# EAGLE design lcd_backpack (EAGLE 6.5.0)
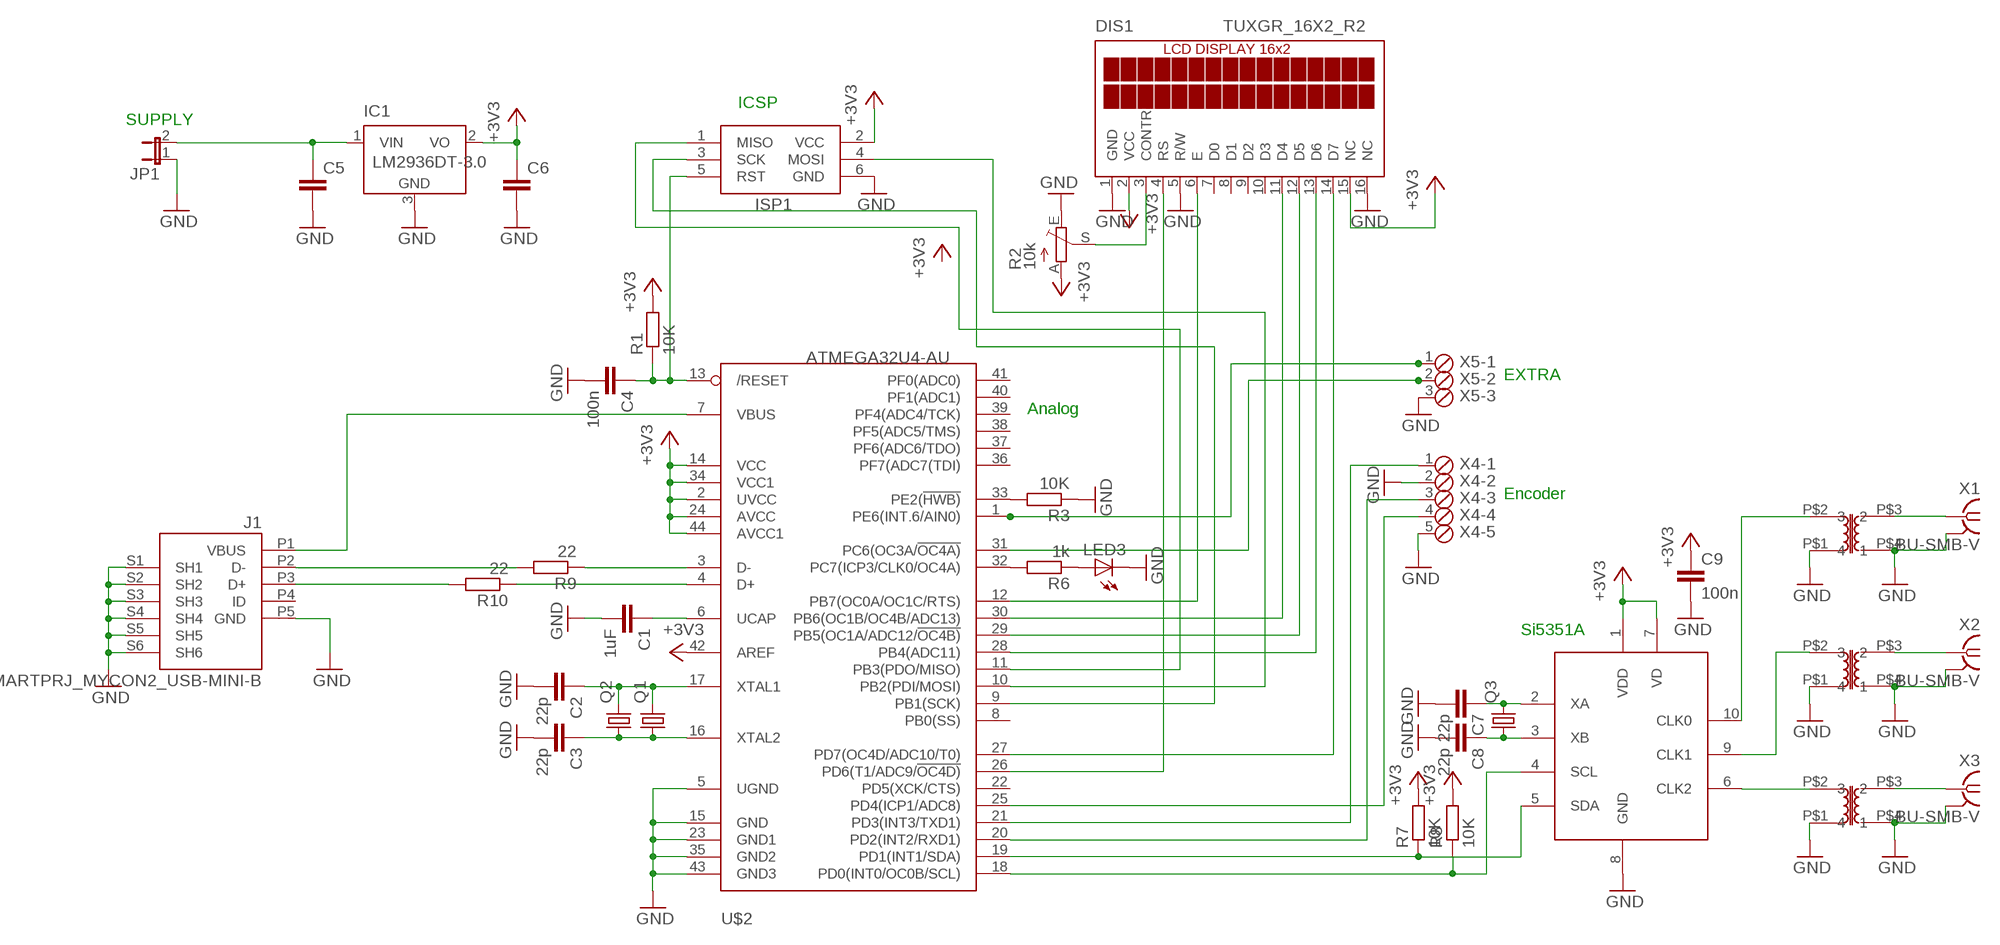
[diagram p0: schematic, sheet 1]

## Parts
C1  1uF  C-EUC0805  [C0805]
C2  22p  C-EUC0805  [C0805]
C3  22p  C-EUC0805  [C0805]
C4  100n  C-EUC0805  [C0805]
C5  C-EUC0805  [C0805]
C6  C-EUC0805  [C0805]
C7  22p  C-EUC0805  [C0805]
C8  22p  C-EUC0805  [C0805]
C9  100n  C-EUC0805  [C0805]
DIS1  TUXGR_16X2_R2  [TUXGR_16X2_R2]
IC1  LM2936DT-3.0  [TO252]
ISP1  AVRISP-6  [AVRISP]
J1  SMARTPRJ_MYCON2_USB-MINI-B  [SMARTPRJ_CON2_USB_MICRO_B_AT]
JP1  JUMPER-2PTH_LOCK  [1X02_LOCK]
LED3  LED3MM  [LED3MM]
Q1  CRYSTALHC49UP  [HC49UP]
Q2  CRYSTALHC49U-V  [HC49U-V]
Q3  CRYSTALCTS406  [CTS406]
R1  10K  R-EU_M0805  [M0805]
R2  10k  TRIM_EU-B25P  [B25P]
R3  10K  R-EU_M0805  [M0805]
R6  1k  R-EU_M0805  [M0805]
R7  10K  R-EU_M0805  [M0805]
R8  10K  R-EU_M0805  [M0805]
R9  22  R-EU_M0805  [M0805]
R10  22  R-EU_M0805  [M0805]
TR1  FT2402_TRAFO  [2402_TRAFO]
TR2  FT2402_TRAFO  [2402_TRAFO]
TR3  FT2402_TRAFO  [2402_TRAFO]
U$1  SI5351  [MSOP10]
U$2  ATMEGA32U4-AU  [TQFP44]
X1  BU-SMB-V  [BU-SMB-V]
X2  BU-SMB-V  [BU-SMB-V]
X3  BU-SMB-V  [BU-SMB-V]
X4  MPT5  [5POL254]
X5  MPT3  [3POL254]

## Nets
+3V3: C6.1 C9.1 DIS1.2(VCC) DIS1.15(NC) IC1.2(VO) ISP1.2(VCC) R1.2 R2.A R7.2 R8.2 U$1.1(VDD) U$1.7(VD) U$2.2(UVCC) U$2.14(VCC) U$2.24(AVCC) U$2.34(VCC1) U$2.42(AREF) U$2.44(AVCC1)
GND: C1.2 C2.2 C3.2 C4.2 C5.2 C6.2 C7.2 C8.2 C9.2 DIS1.1(GND) DIS1.5(R/W) DIS1.16(NC) IC1.3(GND) ISP1.6(GND) J1.P5(GND) J1.S1(SH1) J1.S2(SH2) J1.S3(SH3) J1.S4(SH4) J1.S5(SH5) J1.S6(SH6) JP1.1 LED3.K(C) R2.E R3.1 TR1.P$1 TR1.P$4 TR2.P$1 TR2.P$4 TR3.P$1 TR3.P$4 U$1.8(GND) U$2.5(UGND) U$2.15(GND) U$2.23(GND1) U$2.35(GND2) U$2.43(GND3) X1.2 X1.3 X1.4 X1.5 X2.2 X2.3 X2.4 X2.5 X3.2 X3.3 X3.4 X3.5 X4.2 X4.5 X5.3
N$1: J1.P3(D+) R10.2
N$2: J1.P2(D-) R9.2
N$3: J1.P1(VBUS) U$2.7(VBUS)
N$4: DIS1.4(RS) U$2.26(PD6(T1/ADC9/!OC4D))
N$5: C1.1 U$2.6(UCAP)
N$6: DIS1.6(E) U$2.12(PB7(OC0A/OC1C/RTS))
N$7: C2.1 Q1.2 Q2.2 U$2.17(XTAL1)
N$8: C3.1 Q1.1 Q2.1 U$2.16(XTAL2)
N$9: C4.1 ISP1.5(RST) R1.1 U$2.13(/RESET)
N$10: DIS1.3(CONTR) R2.S
N$11: DIS1.11(D4) U$2.30(PB6(OC1B/OC4B/ADC13))
N$12: DIS1.12(D5) U$2.29(PB5(OC1A/ADC12/!OC4B))
N$13: DIS1.13(D6) U$2.28(PB4(ADC11))
N$14: DIS1.14(D7) U$2.27(PD7(OC4D/ADC10/T0))
N$15: TR3.P$3 X3.1
N$16: C5.1 IC1.1(VIN) JP1.2
N$17: TR2.P$3 X2.1
N$18: TR1.P$3 X1.1
N$19: R8.1 U$1.4(SCL) U$2.18(PD0(INT0/OC0B/SCL))
N$20: R7.1 U$1.5(SDA) U$2.19(PD1(INT1/SDA))
N$21: ISP1.4(MOSI) U$2.10(PB2(PDI/MOSI))
N$22: C8.1 Q3.1 U$1.3(XB)
N$23: C7.1 Q3.3 U$1.2(XA)
N$24: TR1.P$2 U$1.10(CLK0)
N$25: TR2.P$2 U$1.9(CLK1)
N$26: TR3.P$2 U$1.6(CLK2)
N$27: R3.2 U$2.33(PE2(!HWB))
N$28: U$2.20(PD2(INT2/RXD1)) X4.3
N$29: U$2.21(PD3(INT3/TXD1)) X4.1
N$30: U$2.25(PD4(ICP1/ADC8)) X4.4
N$31: U$2.31(PC6(OC3A/!OC4A)) X5.2
N$32: U$2.1(PE6(INT.6/AIN0)) X5.1
N$33: ISP1.3(SCK) U$2.9(PB1(SCK))
N$34: ISP1.1(MISO) U$2.11(PB3(PDO/MISO))
N$42: R6.2 U$2.32(PC7(ICP3/CLK0/OC4A))
N$43: LED3.A R6.1
N$44: R9.1 U$2.3(D-)
N$45: R10.1 U$2.4(D+)
Unconnected: DIS1.7(D0) DIS1.8(D1) DIS1.9(D2) DIS1.10(D3) J1.P4(ID) U$2.8(PB0(SS)) U$2.22(PD5(XCK/CTS)) U$2.36(PF7(ADC7(TDI)) U$2.37(PF6(ADC6/TDO)) U$2.38(PF5(ADC5/TMS)) U$2.39(PF4(ADC4/TCK)) U$2.40(PF1(ADC1)) U$2.41(PF0(ADC0))

## Notes on the sheet
- ICSP
- SUPPLY
- EXTRA
- Analog
- Encoder
- Si5351A

## Library data of the parts
C1-C9 = rcl:C-EU: CAPACITOR, European symbol
DIS1 = display-lcd:TUXGR_16X2_R2: Tuxgraphics LCD display 16x2 characters reflective, without background light Source: tuxgr_12x2_r2.pdf; OC_FARNELL: unknown; OC_NEWARK: unknown
IC1 = national-semiconductor:LM2936?*: Ultra-Low Quiescent Current LDO Voltage Regulator Source: Data sheet <http://www.national.com/ds/LM/LM2936.pdf>; MF: NATIONAL SEMICONDUCTOR; MPN: LM2936DT-3.0; OC_FARNELL: 1286862; OC_NEWARK: 74C4101
ISP1 = adafruit:AVRISP: AVR ISP HEADER Standard 6 pin header for AVR programming
J1 = Arduino_Leonardo-REV3b_lbr:SMARTPRJ_MYCON2_USB-MINI-B
JP1 = SparkFun:JUMPER-2: Jumper Basic 0.1" spaced jumper. Use with breakaway headers.
LED3 = led:LED: LED OSRAM: - CHIPLED LG R971, LG N971, LY N971, LG Q971, LY Q971, LO R971, LY R971 LH N974, LH R974 LS Q976, LO Q976, LY Q976 LO Q996 - Hyper CHIPLED LW Q18S LB Q993, LB Q99A, LB R99A - SideLED LS A670, LO A670, LY A670, LG A670, LP A670 LB A673, LV A673, LT A673, LW A673 LH A674 LY A675 LS A676, LA A676, LO A676, LY A676, LW A676 LS A679, LY A679, LG A679 - Hyper Micro SIDELED® LS Y876, LA Y876, LO Y876, LY Y876 LT Y87S - SmartLED LW L88C, LW L88S LB L89C, LB L89S, LG L890 LS L89K, LO L89K, LY L89K LS L896, LA L896, LO L896, LY L896 - TOPLED LS T670, LO T670, LY T670, LG T670, LP T670 LSG T670, LSP T670, LSY T670, LOP T670, LYG T670 LG T671, LOG T671, LSG T671 LB T673, LV T673, LT T673, LW T673 LH T674 LS T676, LA T676, LO T676, LY T676, LB T676, LH T676, LSB T676, LW T676 LB T67C, LV T67C, LT T67C, LS T67K, LO T67K, LY T67K, LW E67C LS E67B, LA E67B, LO E67B, LY E67B, LB E67C, LV E67C, LT E67C LW T67C LS T679, LY T679, LG T679 LS T770, LO T770, LY T770, LG T770, LP T770 LB T773, LV T773, LT T773, LW T773 LH T774 LS E675, LA E675, LY E675, LS T675 LS T776, LA T776, LO T776, LY T776, LB T776 LHGB T686 LT T68C, LB T68C - Hyper Mini TOPLED® LB M676 - Mini TOPLED Santana® LG M470 LS M47K, LO M47K, LY M47K Source: http://www.osram.convergy.de LUXEON: - LUMILED® LXK2-PW12-R00, LXK2-PW12-S00, LXK2-PW14-U00, LXK2-PW14-V00 LXK2-PM12-R00, LXK2-PM12-S00, LXK2-PM14-U00 LXK2-PE12-Q00, LXK2-PE12-R00, LXK2-PE12-S00, LXK2-PE14-T00, LXK2-PE14-U00 LXK2-PB12-K00, LXK2-PB12-L00, LXK2-PB12-M00, LXK2-PB14-N00, LXK2-PB14-P00, LXK2-PB14-Q00 LXK2-PR12-L00, LXK2-PR12-M00, LXK2-PR14-Q00, LXK2-PR14-R00 LXK2-PD12-Q00, LXK2-PD12-R00, LXK2-PD12-S00 LXK2-PH12-R00, LXK2-PH12-S00 LXK2-PL12-P00, LXK2-PL12-Q00, LXK2-PL12-R00 Source: www.luxeon.com KINGBRIGHT: KA-3528ASYC Source: www.kingbright.com
Q1 Q3 = crystal:CRYSTAL: CRYSTAL; OC_FARNELL: unknown; OC_NEWARK: unknown
Q2 = crystal:CRYSTAL: CRYSTAL; OC_FARNELL: 1666969; OC_NEWARK: unknown
R1 R3 R6-R10 = rcl:R-EU_: RESISTOR, European symbol
R2 = pot:TRIM_EU-: POTENTIOMETER
TR1-TR3 = ref-packages:FT2402_TRAFO
U$1 = ref-packages:SI5351
U$2 = adafruit:ATMEGA32U4: http://www.ladyada.net/library/eagle
X1-X3 = con-coax:BU-SMB-V: FEMALE SMB CONNECTOR Radiall distributor RS 112-2993; OC_FARNELL: unknown; OC_NEWARK: unknown
X4 = con-phoenix-254:MPT5: PHOENIX CONNECTOR; OC_FARNELL: unknown; OC_NEWARK: unknown
X5 = con-phoenix-254:MPT3: PHOENIX CONNECTOR; OC_FARNELL: unknown; OC_NEWARK: unknown

## Board
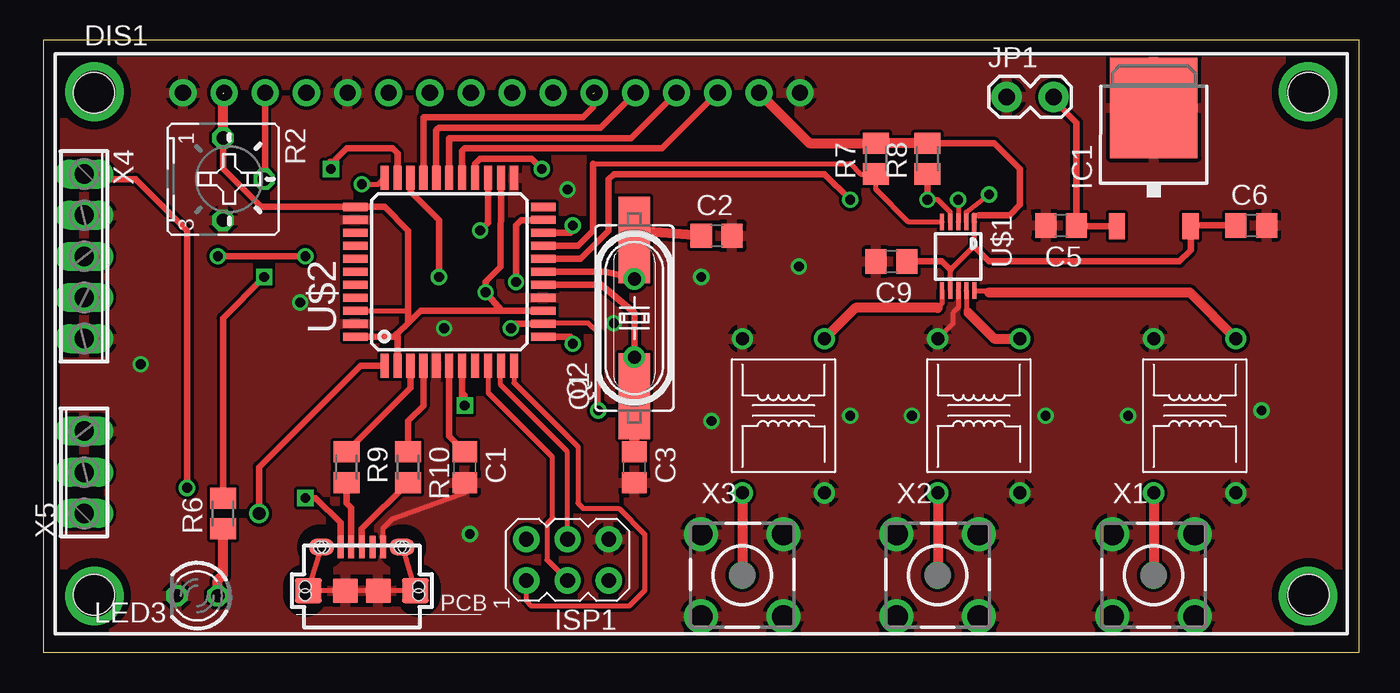
[diagram p1: board, top side]
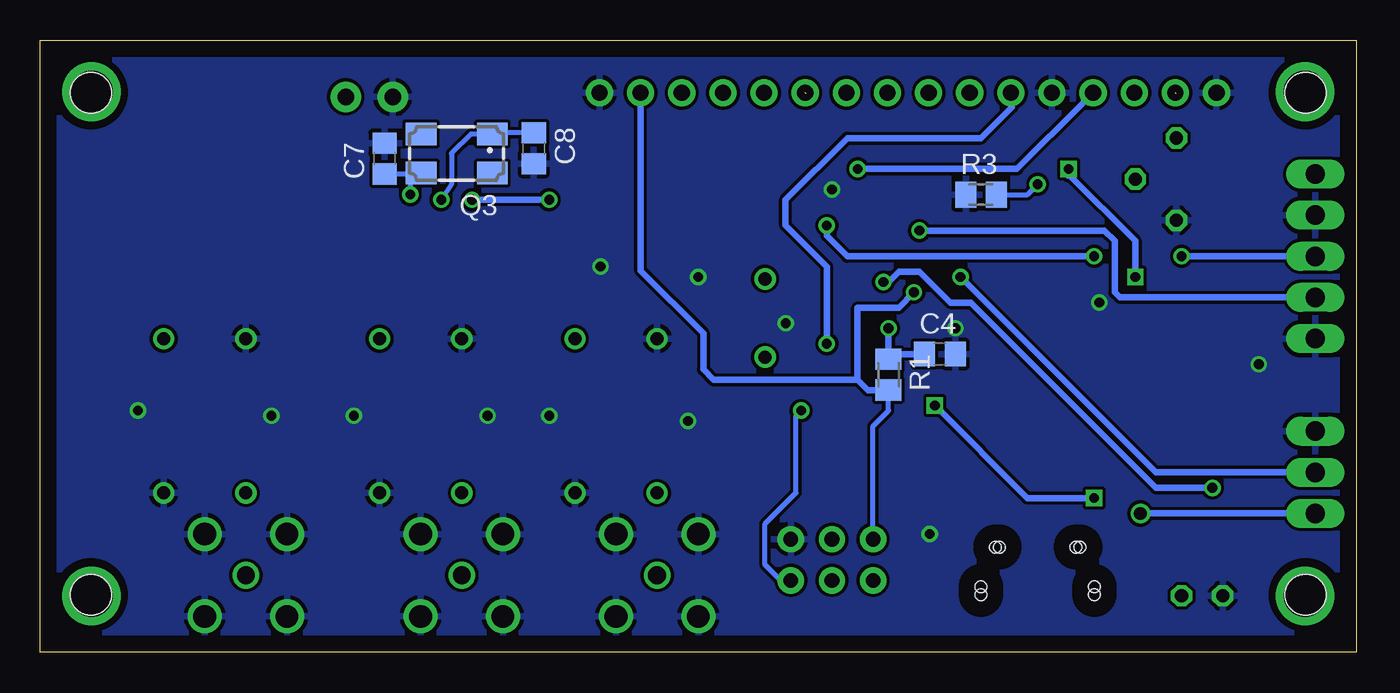
[diagram p2: board, bottom side, seen from below]

Size 81.26 x 37.77 mm. Coordinates in mm from the lower left corner, seen from the top.
Outline: 0,0 81.26,0 81.26,37.77 0,37.77 0,0
Copper layers (1*16): Top 0.035mm / dielectric 1.5mm / Bottom 0.035mm
Design rules "default *": minimum track width 10mil, minimum drill 24mil, track to track 8mil, track to pad 8mil, pad to pad 8mil, via to via 8mil, smd to smd 8mil, copper to edge 40mil, drill to drill 8mil, minimum pad ring 10mil, minimum via ring 8mil, stop-mask expansion 4mil, vias tented up to drill 7mm, thermal gap 10mil

### Footprints (pad centres in the part's own frame; a part is rotated, then mirrored left to right if it is on the bottom)
C0805 = smd 1.3 x 1.5: 1 -0.95,0; 2 0.95,0
TUXGR_16X2_R2 = drill 1 pad 1.676: 1 -32,15.5; 2 -29.46,15.5; 3 -26.92,15.5; 4 -24.38,15.5; 5 -21.84,15.5; 6 -19.3,15.5; 7 -16.76,15.5; 8 -14.22,15.5; 9 -11.68,15.5; 10 -9.14,15.5; 11 -6.6,15.5; 12 -4.06,15.5; 13 -1.52,15.5; 14 1.02,15.5; 15 3.56,15.5; 16 6.1,15.5 | hole 2.5: -37.5,-15.5; 37.5,-15.5; -37.5,15.5; 37.5,15.5
TO252 = smd 1 x 1.6: 1 -2.28,-4.8; 2 2.28,-4.8 | smd 5.4 x 6.2: 3 0,2.5
AVRISP = drill 0.9 pad 1.626: 1 -1.27,2.54; 2 1.27,2.54; 3 -1.27,0; 4 1.27,0; 5 -1.27,-2.54; 6 1.27,-2.54
SMARTPRJ_CON2_USB_MICRO_B_AT = smd 0.406 x 1.346: P1 -1.321,2.692; P2 -0.66,2.692; P3 0,2.692; P4 0.66,2.692; P5 1.321,2.692 | smd 1.651 x 1.549: S1 -3.302,0; S2 3.302,0 | smd 1.524 x 1.016: S3 -2.489,2.692; S4 2.489,2.692 | smd 1.524 x 1.524: S5 -1.016,0; S6 1.016,0 | hole 0.7: -3.505,0.254; -3.505,-0.254; 3.505,0.254; 3.505,-0.254; -2.616,2.692; -2.362,2.692; 2.362,2.692; 2.616,2.692
1X02_LOCK = drill 1.016 pad 1.88: 1 -0.178,0; 2 2.718,0
LED3MM = drill 0.813 octagon: A -1.27,0; K 1.27,0
HC49UP = smd 5.334 x 1.93: 1 -4.826,0; 2 4.826,0
HC49U-V = drill 0.813: 1 -2.413,0; 2 2.413,0
CTS406 = smd 1.9 x 1.4: 1 -2.2,-1.2; 2 2.2,-1.2; 3 2.2,1.2; 4 -2.2,1.2
M0805 = smd 1.3 x 1.6: 1 -0.95,0; 2 0.95,0
B25P = drill 0.813 octagon: A -2.54,0; E 2.54,0; S 0,2.54
2402_TRAFO = drill 0.8: P$1 -1.27,0.635; P$2 -1.27,5.715; P$3 8.255,0.635; P$4 8.255,5.715
MSOP10 = smd 0.25 x 1: 1 -1,-2.113; 2 -0.5,-2.113; 3 0,-2.113; 4 0.5,-2.113; 5 1,-2.113; 6 1,2.113; 7 0.5,2.113; 8 0,2.113; 9 -0.5,2.113; 10 -1,2.113
TQFP44 = smd 1.5 x 0.5: 1 -5.8,4; 2 -5.8,3.2; 3 -5.8,2.4; 4 -5.8,1.6; 5 -5.8,0.8; 6 -5.8,0; 7 -5.8,-0.8; 8 -5.8,-1.6; 9 -5.8,-2.4; 10 -5.8,-3.2; 11 -5.8,-4; 23 5.8,-4; 24 5.8,-3.2; 25 5.8,-2.4; 26 5.8,-1.6; 27 5.8,-0.8; 28 5.8,0; 29 5.8,0.8; 30 5.8,1.6; 31 5.8,2.4; 32 5.8,3.2; 33 5.8,4 | smd 0.5 x 1.5: 12 -4,-5.8; 13 -3.2,-5.8; 14 -2.4,-5.8; 15 -1.6,-5.8; 16 -0.8,-5.8; 17 0,-5.8; 18 0.8,-5.8; 19 1.6,-5.8; 20 2.4,-5.8; 21 3.2,-5.8; 22 4,-5.8; 34 4,5.8; 35 3.2,5.8; 36 2.4,5.8; 37 1.6,5.8; 38 0.8,5.8; 39 0,5.8; 40 -0.8,5.8; 41 -1.6,5.8; 42 -2.4,5.8; 43 -3.2,5.8; 44 -4,5.8
BU-SMB-V = drill 1.1: 1 0,0 | drill 1.4: 2 -2.54,2.54; 3 2.54,2.54; 4 2.54,-2.54; 5 -2.54,-2.54
5POL254 = drill 1.2 long: 1 -5.08,0; 2 -2.54,0; 3 0,0; 4 2.54,0; 5 5.08,0
3POL254 = drill 1.2 long: 1 -2.54,0; 2 0,0; 3 2.54,0

### Placement (x,y rotation side)
C1  26.04,11.43 270 top
C2  41.59,25.72 0 top
C3  36.51,11.43 270 top
C4  25.72,18.41 0 bottom
C5  62.87,26.35 180 top
C6  74.61,26.35 0 top
C7  60.01,30.48 90 bottom
C8  50.8,31.11 270 bottom
C9  52.39,24.13 180 top
DIS1  40.64,19.05 0 top
IC1  68.58,31.11 0 top
ISP1  32.38,5.71 90 top
J1  19.68,3.81 0 top
JP1  59.69,34.29 0 top
LED3  9.53,3.49 180 top
Q1  36.51,20.64 90 top
Q2  36.51,20.64 90 top
Q3  55.56,30.8 180 bottom
R1  28.89,17.14 270 bottom
R2  11.11,29.21 270 top
R3  23.18,28.26 0 bottom
R6  11.11,8.57 90 top
R7  51.44,30.48 90 top
R8  54.61,30.48 90 top
R9  18.73,11.43 270 top
R10  22.54,11.43 270 top
TR1  67.94,18.1 270 top
TR2  54.61,18.1 270 top
TR3  42.55,18.1 270 top
U$1  56.52,24.45 180 top
U$2  25.08,23.5 90 top
X1  68.58,4.76 0 top
X2  55.24,4.76 0 top
X3  43.18,4.76 0 top
X4  2.54,24.45 270 top
X5  2.54,11.11 90 top

### Tracks (layer width: path | path; a pad name or v marks a point on that pad's centre or on a via)
+3V3  (via drill 0.6)  (1 unrouted)
  Top 0.305: U$1.1 57.47,26.56 | 57.47,26.56 57.47,25.08 56.02,23.63 U$1.7 | 57.47,26.56 57.47,26.99 57.78,26.99 | U$2.42 22.4,21.09 22.54,20.95
  Top 0.406: R2.A 11.11,29.84 13.46,27.5 U$2.34 21.08,27.5 22.54,26.04 22.54,20.95 22.54,20.32 | 22.54,20.32 21.91,19.68 | 21.91,19.68 21.91,17.72 U$2.2 | U$2.44 21.72,19.5 21.91,19.68 | U$2.14 28.26,21.09 | 28.26,21.09 23.32,21.09 22.54,20.32 | U$2.24 28.26,23.81 27.33,22.89 v27.33,22.23 28.28,21.12 28.26,21.09 | 57.47,25.08 58.42,24.13 70.17,24.13 70.86,24.82 IC1.2 70.9,26.35 C6.1 | 57.78,26.99 59.69,26.99 60.33,27.62 60.33,29.84 58.74,31.43 56.2,31.43 R8.2 | C9.1 55.52,24.13 56.02,23.63
  Top 0.61: R8.2 R7.2 47.32,31.43 DIS1.15 | R2.A 11.11,34.48
  Bottom 0.305: ISP1.2 29.84,13.97 28.89,14.92 R1.2
  Bottom 0.406: R1.2 30.16,16.2 30.8,16.83 | 30.8,16.83 30.8,21.27 28.26,21.27 v27.33,22.23 | 30.8,16.83 39.69,16.83 40.32,17.46 40.32,19.68 44.2,23.56 DIS1.15
GND  (via drill 0.6)
  Top 0.305: U$1.8 56.52,21.27 56.2,20.95 56.2,20.32 TR2.P$1 | J1.P5 21.01,7.67 21.59,8.26 26.04,9.84 C1.2 | J1.S4 22.23,6.35 J1.S2 J1.S6 J1.S5 J1.S1 J1.S3
  other vias: 32.38,28.57 24.77,20 40.64,23.18 46.67,23.81 15.88,21.59 6.03,17.78 35.24,20.32 41.27,14.29 49.85,14.61 53.66,14.61 61.91,14.61 66.99,14.61 75.25,14.92 26.35,7.3
  pour Bottom: -0.32,38.1 82.23,38.1 82.23,-0.64 -0.32,-0.64
  pour Top: -0.64,38.73 82.23,38.73 82.23,-1.27 -0.64,-1.27
N$1
  Top 0.406: J1.P3 19.68,7.62 R10.2
N$2
  Top 0.406: J1.P2 19.02,8.91 18.73,9.21 R9.2
N$3  (via drill 0.6)
  Top 0.406: J1.P1 18.36,7.99 16.83,9.53 v16.19,9.53 | 26.04,15.88 v26.04,15.24 25.88,15.39 U$2.7
  Bottom 0.406: v16.19,9.53 20.32,9.53 v26.04,15.24
N$4  (via drill 0.6)
  Top 0.406: U$2.26 26.68,30.18 26.99,30.48 30.16,30.48 v30.8,29.84
  Bottom 0.406: v30.8,29.84 20.95,29.84 16.83,33.97 16.83,33.98 DIS1.4
N$5
  Top 0.406: U$2.6 25.08,13.33 C1.1
N$6  (via drill 0.6)
  Top 0.406: U$2.12 32.58,19.5 v32.7,19.05
  Bottom 0.406: v32.7,19.05 32.7,23.81 35.24,26.35 35.24,27.94 31.43,31.75 23.18,31.75 21.27,33.66 21.27,34.48 DIS1.6
N$7
  Top 0.406: U$2.17 34.73,23.5 Q2.2
  Top 0.61: C2.1 36.51,26.04 Q1.2 Q2.2
N$8
  Top 0.406: U$2.16 34.45,22.7 36.51,20.95 Q2.1
  Top 0.61: Q2.1 Q1.1 C3.1
N$9  (via drill 0.6)
  Top 0.305: v34.29,14.92 34.29,19.68 33.66,20.32 30.91,20.32 U$2.13
  Top 0.406: U$2.13 29.18,20.3 v28.89,20
  Bottom 0.305: ISP1.5 35.56,4.45 36.51,5.4 36.51,7.94 34.61,9.84 34.61,14.61 v34.29,14.92
  Bottom 0.406: C4.1 28.57,18.41 R1.1 v28.89,20
N$10
  Top 0.406: 13.72,29.28 DIS1.3
  Top 0.61: 13.72,29.28 R2.S
N$11  (1 unrouted)
  Top 0.406: U$2.30 23.48,33.01 23.5,33.02 33.34,33.02 33.97,33.66 33.97,34.48
N$12
  Top 0.406: U$2.29 24.28,32.22 24.45,32.38 34.41,32.38 DIS1.12
N$13
  Top 0.406: U$2.28 25.08,31.75 36.32,31.75 DIS1.13
N$14
  Top 0.406: U$2.27 25.88,30.96 26.04,31.11 38.23,31.11 DIS1.14
N$15
  Top 0.61: TR3.P$3 X3.1
N$16
  Top 0.406: IC1.1 63.85,26.32 C5.1 63.82,32.7 62.41,34.11 JP1.2
N$17
  Top 0.61: TR2.P$3 X2.1
N$18
  Top 0.61: TR1.P$3 X1.1
N$19  (via drill 0.6)
  Top 0.305: U$1.4 56.02,27.17 55.24,27.94 v54.61,27.94
  Top 0.406: U$2.18 33.19,24.3 34.92,26.04 34.92,29.21 35.24,29.53 48.26,29.53 v49.85,27.94 | v54.61,27.94 R8.1
  Bottom 0.406: v49.85,27.94 v54.61,27.94
N$20
  Top 0.305: U$1.5 53.45,26.56 51.44,28.57 R7.1 50.48,29.53 49.85,30.16 33.97,30.16
  Top 0.406: U$2.19 33.03,25.09 33.97,26.04 33.97,30.16
N$21
  Top 0.305: ISP1.4 32.38,12.38 28.26,16.51 28.26,17.67 U$2.10
N$22  (via drill 0.6)
  Top 0.305: v56.52,27.94 U$1.3
  Bottom 0.305: C8.1 53.3,32.06 Q3.1 54.68,32 55.88,30.8 55.88,28.89 v56.52,27.94
N$23  (via drill 0.6)
  Top 0.305: U$1.2 57.02,27.17 v58.42,28.26
  Bottom 0.305: v58.42,28.26 58.42,29.57 | C7.1 57.83,29.53 58.42,29.57 | 58.42,29.57 Q3.3
N$24
  Top 0.305: U$1.10 58.31,22.33 58.42,22.23
  Top 0.61: 58.42,22.23 70.8,22.23 TR1.P$2
N$25
  Top 0.305: U$1.9 57.02,21.09 57.15,20.95
  Top 0.61: 57.15,20.95 58.74,19.37 TR2.P$2
N$26
  Top 0.305: U$1.6 55.52,21.54 55.24,21.27
  Top 0.61: 55.24,21.27 50.16,21.27 TR3.P$2
N$27  (via drill 0.6)
  Top 0.305: v19.68,28.89 20.68,28.89 U$2.33
  Bottom 0.305: R3.2 20.32,28.26 v19.68,28.89
N$28  (via drill 0.6)
  Top 0.406: U$2.20 32.56,25.89 v32.7,26.35 | v10.79,24.45 v16.19,24.45
  Bottom 0.406: v32.7,26.35 32.7,25.72 31.43,24.45 v16.19,24.45 | X4.3 v10.79,24.45
N$29  (via drill 0.6, 0.61)
  Top 0.254: 3.81,29.21 2.54,29.21 X4.1 | 30.48,26.67 U$2.21
  Top 0.406: 30.48,26.67 29.53,26.67 29.21,26.35 v29.21,22.86 | 3.81,29.21 5.71,29.21 8.89,26.04 v8.89,10.16
  Bottom 0.406: v29.21,22.86 28.89,22.86 28.26,23.5 26.99,23.5 25.08,21.59 23.81,21.59 12.38,10.16 v8.89,10.16
N$30  (via drill 0.6)
  Top 0.406: U$2.25 27.48,26.53 v26.99,26.04
  Bottom 0.406: v26.99,26.04 15.56,26.04 14.92,25.4 14.92,22.23 14.61,21.91 X4.4
N$31  (via drill 0.6)
  Top 0.406: U$2.31 22.68,28.43 24.45,26.67 v24.45,23.18
  Bottom 0.406: X5.2 12.38,11.11 v24.45,23.18
N$32  (via drill 0.8)
  Top 0.406: U$2.1 19.6,17.7 13.34,11.43 v13.34,8.57
  Bottom 0.406: v13.34,8.57 X5.1
N$33
  Top 0.305: U$2.9 27.48,16.02 31.43,12.06 31.43,8.26 31.11,7.94 31.11,5.71 ISP1.3
N$34
  Top 0.305: U$2.11 29.08,16.64 33.02,12.7 33.02,9.21 33.34,8.89 35.56,8.89 37.15,7.3 37.15,3.81 36.2,2.86 30.16,2.86 29.84,3.17 ISP1.1
N$42  (via drill 0.6)
  Top 0.406: U$2.32 21.88,30.82 21.59,31.11 18.73,31.11 18.1,30.48 18.1,30.16 v17.78,29.84 | v13.65,23.18 11.11,20.64 R6.2
  Top 0.61: 17.78,30.16 v17.78,29.84
  Bottom 0.406: 17.78,29.53 13.65,25.4 v13.65,23.18
  Bottom 0.61: v17.78,29.84 17.78,29.53
N$43
  Top 0.61: LED3.A 10.79,4.45 11.11,4.76 R6.1
N$44
  Top 0.406: U$2.3 22.68,16.33 R9.1
N$45
  Top 0.406: U$2.4 23.48,15.23 22.54,14.29 R10.1
N$46  (via drill 2.6)
  other vias: 3.17,3.49
N$47  (via drill 2.6)
  other vias: 3.17,34.61
N$48  (via drill 2.6)
  other vias: 78.11,34.61
N$49  (via drill 2.6)
  other vias: 78.11,3.49